# Altium schematic sheet JIEXIANTU.SchDoc
size A4
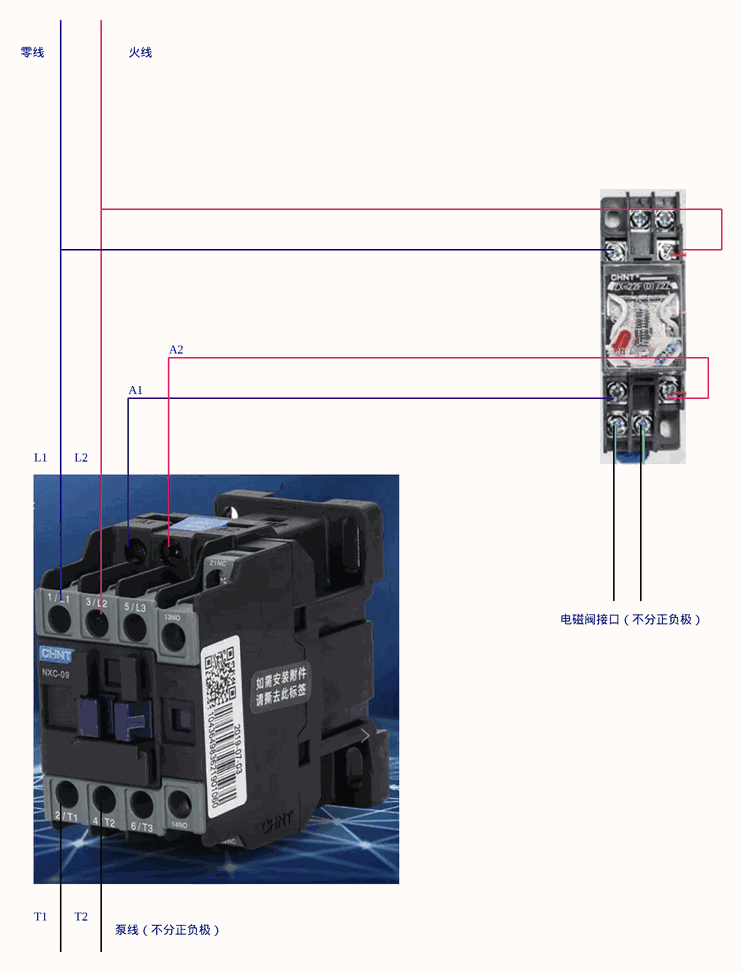
[diagram p0: JIEXIANTU.SchDoc]

## Notes on the sheet
- 零线
- 火线
- A2
- A1
- L1
- L2
- 电磁阀接口（不分正负极）
- T1
- T2
- 泵线（不分正负极）